# Altium schematic sheet TMP75.SchDoc
size A4
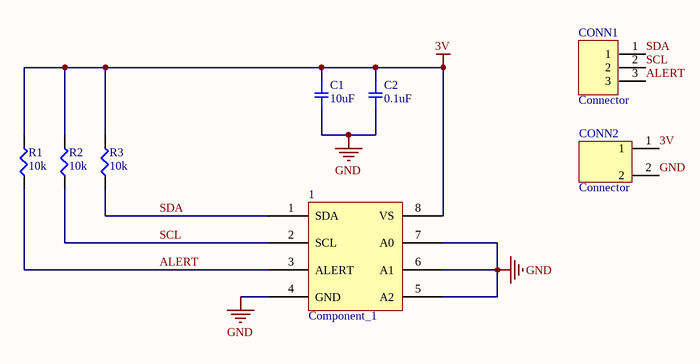
[diagram p0: TMP75.SchDoc]

## Parts
1  Component_1  [TMP75C]
C1  10uF  [SMD-0805C]
C2  0.1uF  [SMD-0805C]
CONN1  Connector  [1x3x2.54 Pin Header TH V]
CONN2  Connector  [1x2x2.54 Pin Header TH V]
R1  10k  [SMD-0805-RES]
R2  10k  [SMD-0805-RES]
R3  10k  [SMD-0805-RES]

## Nets
3V: 1.8(VS) C1.1 C2.1 CONN2.1 R1.2 R2.2 R3.2
GND: 1.4(GND) 1.5(A2) 1.6(A1) 1.7(A0) C1.2 C2.2 CONN2.2
ALERT: 1.3(ALERT) CONN1.3 R1.1
SCL: 1.2(SCL) CONN1.2 R2.1
SDA: 1.1(SDA) CONN1.1 R3.1

## Library data of the parts
C1 = CL21A106KAFN3NE: Cap Ceramic 10uF 25V X5R 10% 0805; Manufacturer: Samsung Electro-Mechanics; Part Number: CL21A106KAFN3NE; Package / Case: 0805; Voltage: 25V; Tolerance: 10%; VALUE: 10uF
C2 = CL21B104JBCNNNC: CAP CER 0.1uF 50V X7T 0805; Part Number: GC321AD72E103KX01D; Manufacturer: Samsung Electro-Mechanics; Tolerance: 5%; Package / Case: 0805; Voltage: 50V; VALUE: 0.1uF
CONN1 = Header 1x3
CONN2 = Header 1x2
R1-R3 = ERJ-P6WJ103V: RES SMD 10K OHM 5% 1/2W 0805; Manufacturer: Panasonic Electronic Components; Factory Stock: 0; Unit Price (USD): 0.08237; @ qty: 1500; Minimum Quantity: 1; Power (Watts): 0.5W, 1/2W; Temperature Coefficient: ±200ppm/°C; Part Number: ERJ-P6WJ103V; Datasheets: https://industrial.panasonic.com/cdbs/www-data/pdf/RDA0000/AOA0000C243.pdf; Image: //media.digikey.com/Renders/Panasonic%20Renders/ERJ-0805%20Pkg.jpg; Digi-Key Part Number: P16966CT-ND; Quantity Available: 2796; Packaging: Cut Tape (CT); Series: ERJ; Part Status: Active; Value: 10k; Tolerance: ±5%; Composition: Thick Film; Features: Automotive AEC-Q200, Pulse Withstanding; Operating Temperature: -55°C ~ 155°C; Package / Case: 0805 (2012 Metric); Supplier Device Package: 0805; Size / Dimension: 0.079" L x 0.049" W (2.00mm x 1.25mm); Height - Seated (Max): 0.030" (0.75mm); Number of Terminations: 2; Failure Rate: -